# Altium schematic sheet OUT_Connectors.SchDoc
size A4; SheetNumber: 15; SheetTotal: 15
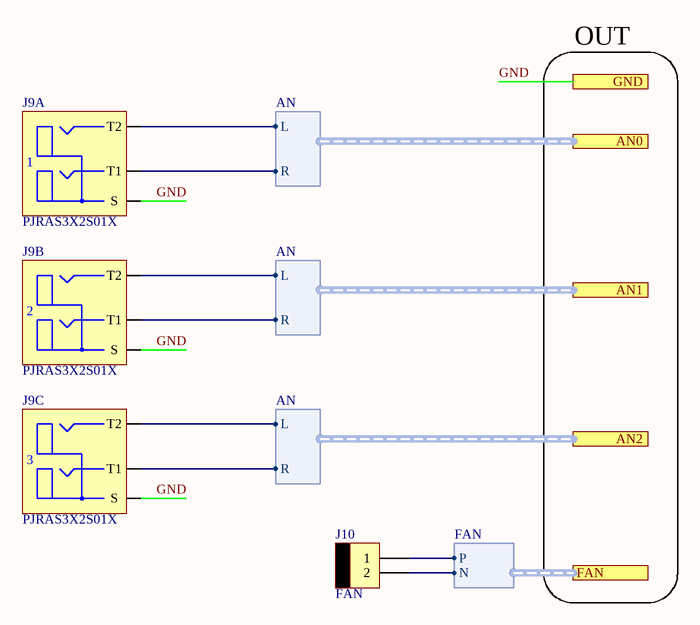
[diagram p0: OUT_Connectors.SchDoc]

## Parts
J9  PJRAS3X2S01X  [RCA2X3-RA]  (parts A,B,C of 3)
J10  FAN  [MOLEX-2]

## Ports
AN0 (harness AN), AN1 (harness AN), AN2 (harness AN), FAN (harness FAN), GND

## Harnesses
AN: L, R
FAN: P, N

## Nets
GND: J9.S1(S) J9.S2(S) J9.S3(S) ; port GND
NetJ9_T1-1: J9.T1-1(T1) ; port AN0.R
NetJ9_T1-2: J9.T1-2(T1) ; port AN1.R
NetJ9_T1-3: J9.T1-3(T1) ; port AN2.R
NetJ9_T2-1: J9.T2-1(T2) ; port AN0.L
NetJ9_T2-2: J9.T2-2(T2) ; port AN1.L
NetJ9_T2-3: J9.T2-3(T2) ; port AN2.L
NetJ10_1: J10.1 ; port FAN.P
NetJ10_2: J10.2 ; port FAN.N

## Notes on the sheet
- OUT
- (in symbol PJRAS3X2S01X, part A) 1
- (in symbol PJRAS3X2S01X, part B) 2
- (in symbol PJRAS3X2S01X, part C) 3

## Library data of the parts
J9 = PJRAS3X2S01X: 3.20mm ID, 9.00mm OD (RCA) Phono (RCA) Jack Mono Connector Solder; Digikey_PN: SC1860-ND
J10 = MOLEX-2